# EAGLE design M594X (EAGLE 6.6.0)
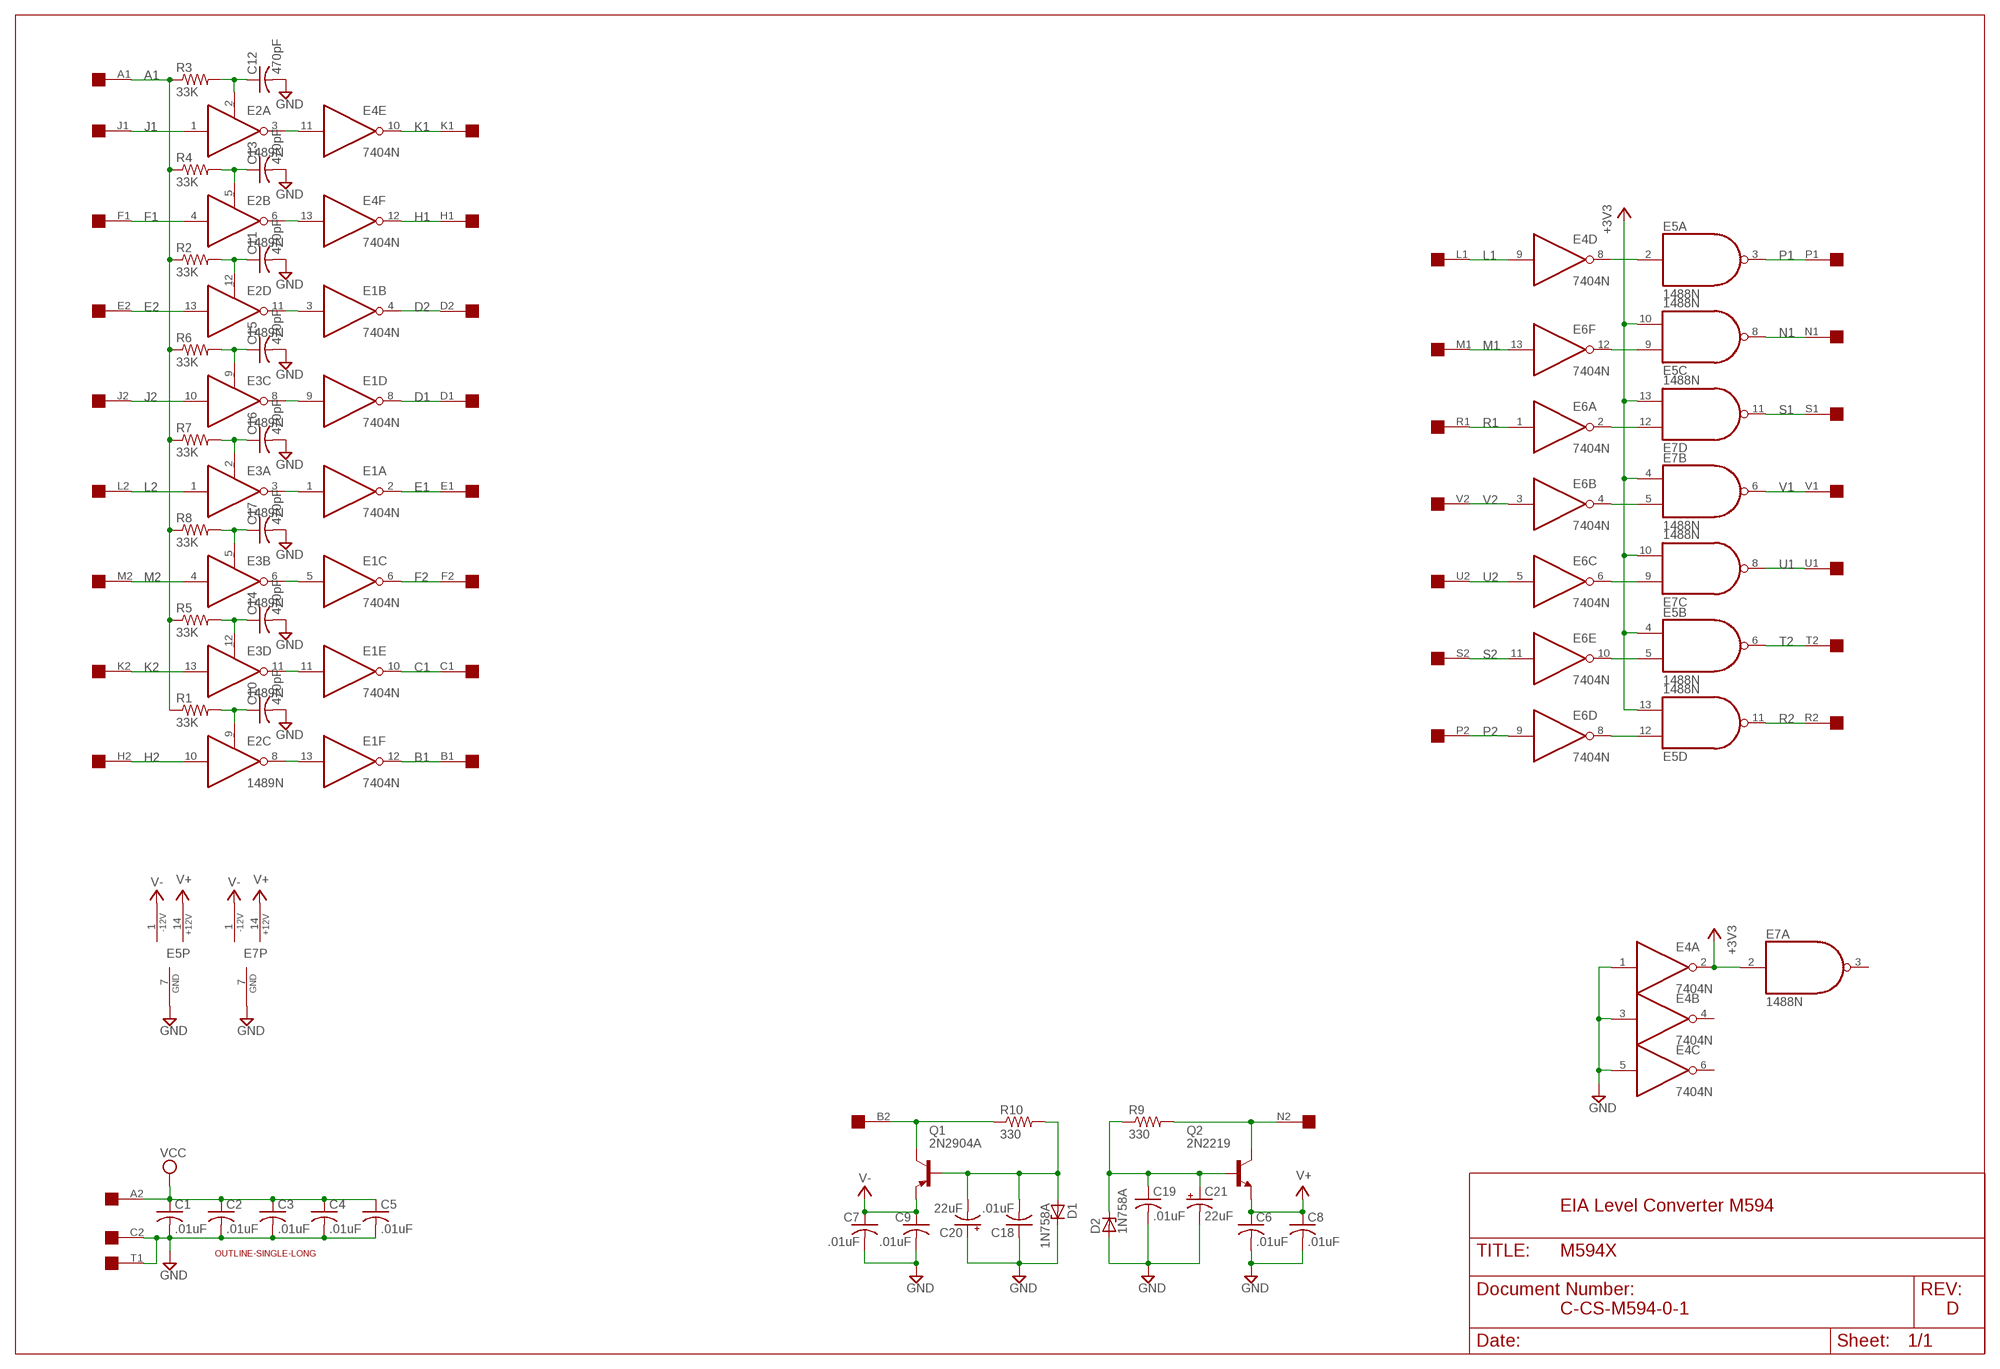
[diagram p0: schematic, sheet 1]

## Parts
C1  .01uF  C-US050-025X075  [C050-025X075]
C2  .01uF  C-US050-025X075  [C050-025X075]
C3  .01uF  C-US050-025X075  [C050-025X075]
C4  .01uF  C-US050-025X075  [C050-025X075]
C5  .01uF  C-US050-025X075  [C050-025X075]
C6  .01uF  C-US050-025X075  [C050-025X075]
C7  .01uF  C-US050-025X075  [C050-025X075]
C8  .01uF  C-US050-025X075  [C050-025X075]
C9  .01uF  C-US050-025X075  [C050-025X075]
C10  470pF  C-US075-032X103  [C075-032X103]
C11  470pF  C-US075-032X103  [C075-032X103]
C12  470pF  C-US075-032X103  [C075-032X103]
C13  470pF  C-US075-032X103  [C075-032X103]
C14  470pF  C-US075-032X103  [C075-032X103]
C15  470pF  C-US075-032X103  [C075-032X103]
C16  470pF  C-US075-032X103  [C075-032X103]
C17  470pF  C-US075-032X103  [C075-032X103]
C18  .01uF  C-US050-025X075  [C050-025X075]
C19  .01uF  C-US050-025X075  [C050-025X075]
C20  22uF  CPOL-USE20-8AXIAL  [E12-8]
C21  22uF  CPOL-USE20-8AXIAL  [E12-8]
D1  1N758A  ZENER-DIODEDO35Z10  [DO35Z10]
D2  1N758A  ZENER-DIODEDO35Z10  [DO35Z10]
E1  7404N  [DIL14]
E2  1489N  [DIL14]
E3  1489N  [DIL14]
E4  7404N  [DIL14]
E5  1488N  [DIL14]
E6  7404N  [DIL14]
E7  1488N  [DIL14]
Q1  2N2904A  -PNP-TO5  [TO5]
Q2  2N2219  -NPN-TO5  [TO5]
R1  33K  R-US_0207/10  [0207/10]
R2  33K  R-US_0207/10  [0207/10]
R3  33K  R-US_0207/10  [0207/10]
R4  33K  R-US_0207/10  [0207/10]
R5  33K  R-US_0207/10  [0207/10]
R6  33K  R-US_0207/10  [0207/10]
R7  33K  R-US_0207/10  [0207/10]
R8  33K  R-US_0207/10  [0207/10]
R9  330  R-US_0207/10  [0207/10]
R10  330  R-US_0207/10  [0207/10]
U$1  OUTLINE-SINGLE-LONG  [SINGLE-LONG]
U$2  SINGLE  [EDGE-CON2]

## Nets
+3V3: E4.2(A:O) E5.4(B:I0) E5.10(C:I1) E5.13(D:I1) E7.2(A:I) E7.4(B:I0) E7.10(C:I1) E7.13(D:I1)
A1 [supply]: R1.1 R2.1 R3.1 R4.1 R5.1 R6.1 R7.1 R8.1 U$2.A1
B1: E1.12(F:O) U$2.B1
B2 [supply]: Q1.3(C) R10.1 U$2.B2
C1: E1.10(E:O) U$2.C1
D1: E1.8(D:O) U$2.D1
D2: E1.4(B:O) U$2.D2
E1: E1.2(A:O) U$2.E1
E2: E2.13(D:I) U$2.E2
F1: E2.4(B:I) U$2.F1
F2: E1.6(C:O) U$2.F2
GND [supply]: C1.2 C2.2 C3.2 C4.2 C5.2 C6.2 C7.2 C8.2 C9.2 C10.2 C11.2 C12.2 C13.2 C14.2 C15.2 C16.2 C17.2 C18.1 C19.2 C20.+ C21.- D1.C D2.A E4.1(A:I) E4.3(B:I) E4.5(C:I) E5.7(P:GND) E7.7(P:GND) U$2.C2 U$2.T1
H1: E4.12(F:O) U$2.H1
H2: E2.10(C:I) U$2.H2
J1: E2.1(A:I) U$2.J1
J2: E3.10(C:I) U$2.J2
K1: E4.10(E:O) U$2.K1
K2: E3.13(D:I) U$2.K2
L1: E4.9(D:I) U$2.L1
L2: E3.1(A:I) U$2.L2
M1: E6.13(F:I) U$2.M1
M2: E3.4(B:I) U$2.M2
N1: E5.8(C:O) U$2.N1
N2 [supply]: Q2.3(C) R9.2 U$2.N2
N$1: C18.2 C20.- D1.A Q1.2(B) R10.2
N$2: C19.1 C21.+ D2.C Q2.2(B) R9.1
N$3: E4.8(D:O) E5.2(A:I)
N$4: E2.3(A:O) E4.11(E:I)
N$5: E5.9(C:I0) E6.12(F:O)
N$6: E6.2(A:O) E7.12(D:I0)
N$7: E6.4(B:O) E7.5(B:I1)
N$8: E6.6(C:O) E7.9(C:I0)
N$9: E5.5(B:I1) E6.10(E:O)
N$10: E5.12(D:I0) E6.8(D:O)
N$11: E2.6(B:O) E4.13(F:I)
N$12: E1.3(B:I) E2.11(D:O)
N$13: E1.9(D:I) E3.8(C:O)
N$14: E1.1(A:I) E3.3(A:O)
N$15: E1.5(C:I) E3.6(B:O)
N$16: E1.11(E:I) E3.11(D:O)
N$17: E1.13(F:I) E2.8(C:O)
N$18: C12.1 E2.2(A:RC) R3.2
N$20: C13.1 E2.5(B:RC) R4.2
N$21: C10.1 E2.9(C:RC) R1.2
N$22: C14.1 E3.12(D:RC) R5.2
N$23: C17.1 E3.5(B:RC) R8.2
N$24: C15.1 E3.9(C:RC) R6.2
N$25: C16.1 E3.2(A:RC) R7.2
N$26: C11.1 E2.12(D:RC) R2.2
P1: E5.3(A:O) U$2.P1
P2: E6.9(D:I) U$2.P2
R1: E6.1(A:I) U$2.R1
R2: E5.11(D:O) U$2.R2
S1: E7.11(D:O) U$2.S1
S2: E6.11(E:I) U$2.S2
T2: E5.6(B:O) U$2.T2
U1: E7.8(C:O) U$2.U1
U2: E6.5(C:I) U$2.U2
V1: E7.6(B:O) U$2.V1
V2: E6.3(B:I) U$2.V2
V+ [supply]: C6.1 C8.1 E5.14(P:+12V) E7.14(P:+12V) Q2.1(E)
V- [supply]: C7.1 C9.1 E5.1(P:-12V) E7.1(P:-12V) Q1.1(E)
VCC [supply]: C1.1 C2.1 C3.1 C4.1 C5.1 U$2.A2
Unconnected: E4.4(B:O) E4.6(C:O) E7.3(A:O)

## Notes on the sheet
- EIA Level Converter M594
- C-CS-M594-0-1 | D

## Power pins joined to a net without a drawn wire
GND: E1.7(P:GND) E2.7(P:GND) E3.7(P:GND) E4.7(P:GND) E6.7(P:GND)
VCC: E1.14(P:VCC) E2.14(P:VCC) E3.14(P:VCC) E4.14(P:VCC) E6.14(P:VCC)

## Library data of the parts
C1-C19 = rcl:C-US: CAPACITOR, American symbol
C20 C21 = dec-con:CPOL-USE20-8AXIAL: A 0.8 inch electrolytic.
D1 D2 = diode:ZENER-DIODE: Z-Diode
E1 E4 E6 = 74xx-us:74*04: Hex INVERTER
E2 E3 = dec-con:14*89: Quad line receivers BUFFER,
E5 E7 = dec-con:14*88: Quad 2-input NAND gate
Q1 = transistor:*-PNP-: PNP Transistror
Q2 = transistor:*-NPN-: NPN Transistror BF959 corrected 2008.03.06
R1-R10 = rcl:R-US_: RESISTOR, American symbol
U$1 = dec-con:OUTLINE-*: Board outlines for DEC boards.
U$2 = dec-con:SINGLE: Single-Height DEC board

## Net classes
1 supply: width 0.813 mm

## Board
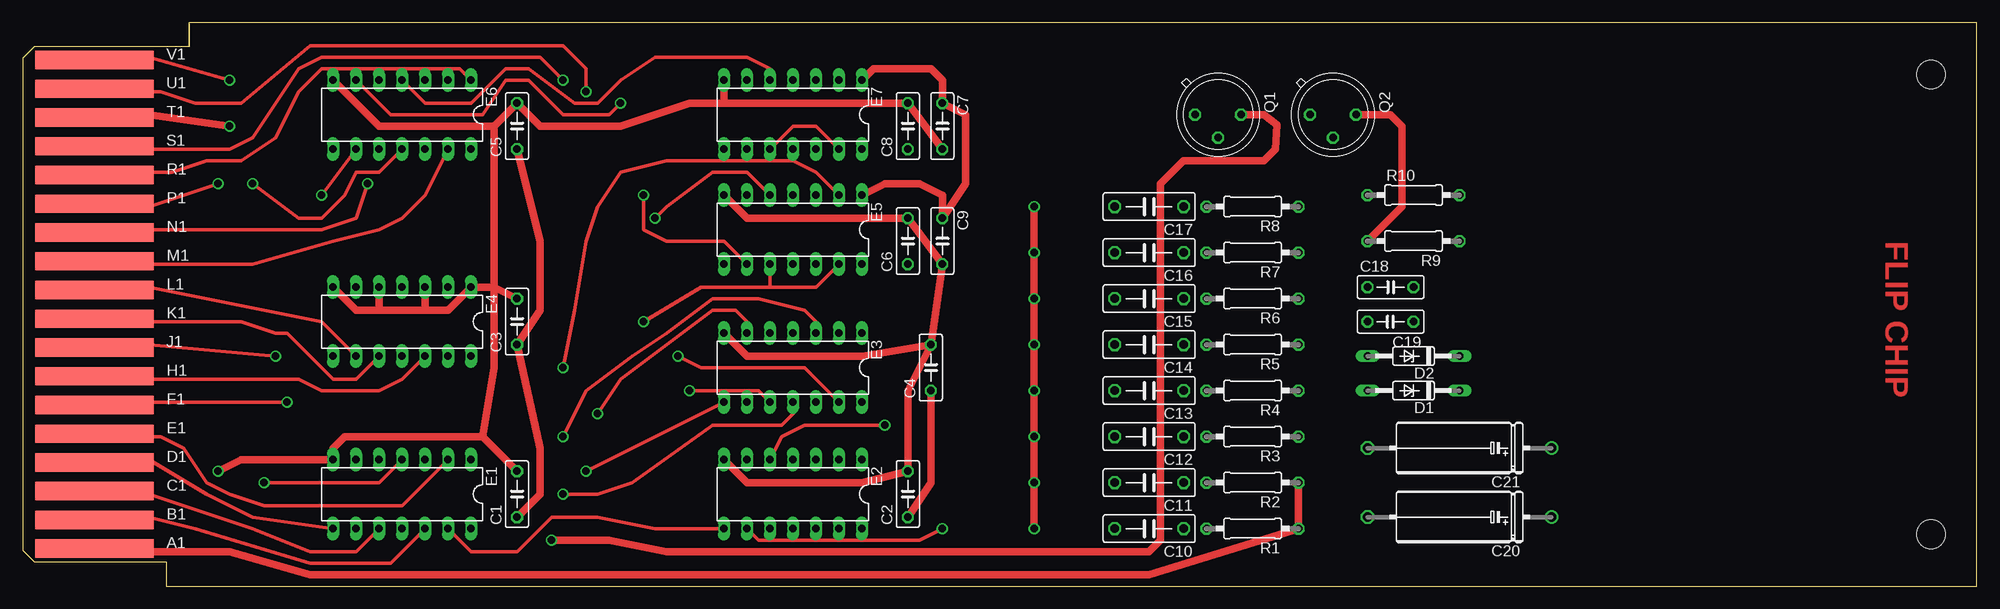
[diagram p1: board, top side]
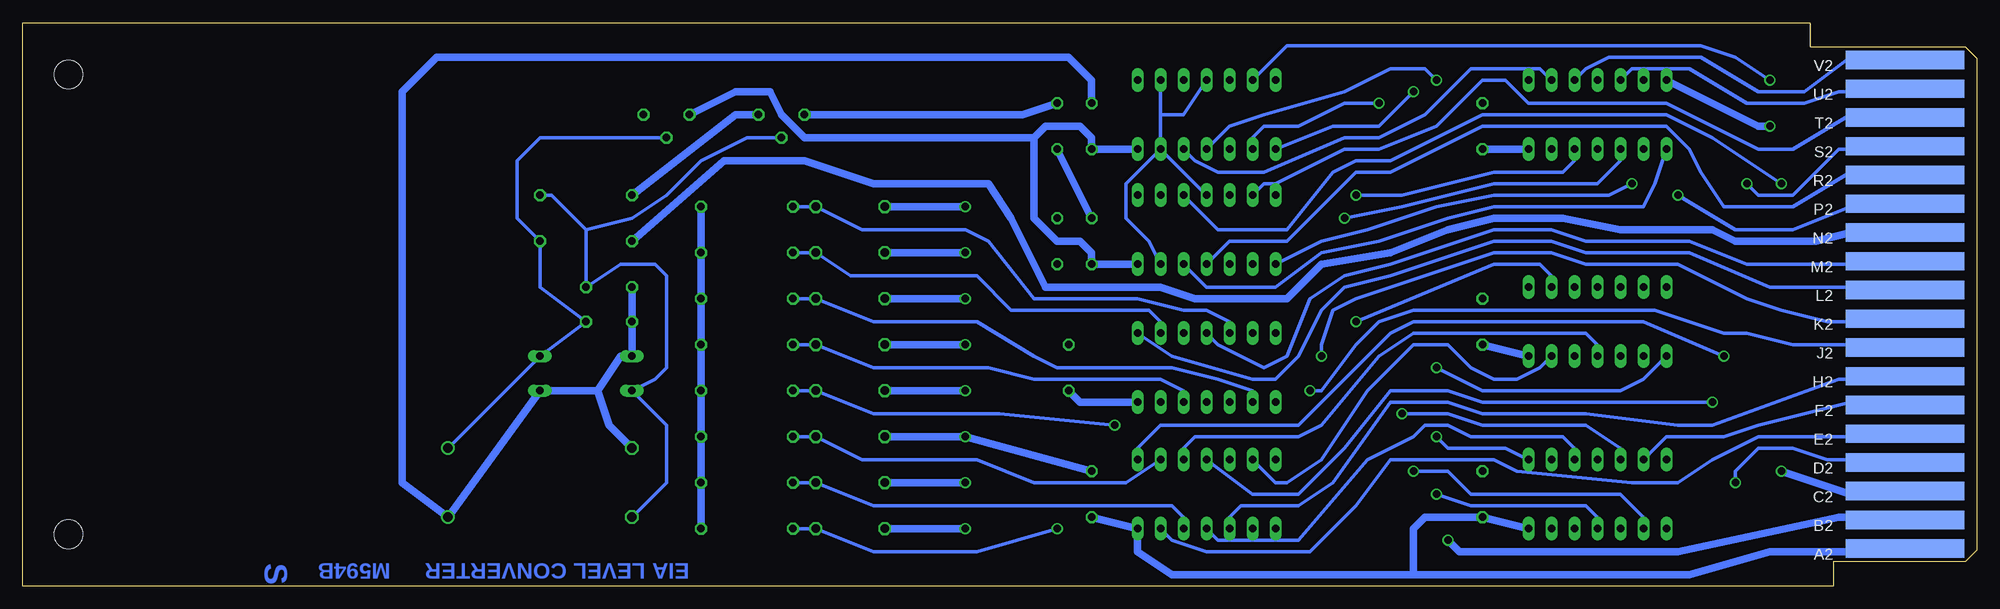
[diagram p2: board, bottom side, seen from below]

Size 215.9 x 62.23 mm. Coordinates in mm from the lower left corner, seen from the top.
Copper layers (1+16): Top 0.035mm / dielectric 1.5mm / Bottom 0.035mm
Design rules "16mils": minimum track width 16mil, minimum drill 32mil, track to track 15mil, track to pad 10mil, pad to pad 10mil, via to via 10mil, smd to smd 10mil, copper to edge 13mil, drill to drill 10mil, minimum pad ring 10mil, minimum via ring 8mil, stop-mask expansion 0mil, vias tented up to drill 0mil, thermal gap 10mil

### Footprints (pad centres in the part's own frame; a part is rotated, then mirrored left to right if it is on the bottom)
C050-025X075 = drill 0.813 octagon: 1 -2.54,0; 2 2.54,0
C075-032X103 = drill 0.914 octagon: 1 -3.81,0; 2 3.81,0
E12-8 = drill 1.016: + -10.16,0 | drill 1.016 octagon: - 10.16,0
DO35Z10 = drill 0.813 long: A 5.08,0; C -5.08,0
DIL14 = drill 0.813 long: 1 -7.62,-3.81; 2 -5.08,-3.81; 3 -2.54,-3.81; 4 0,-3.81; 5 2.54,-3.81; 6 5.08,-3.81; 7 7.62,-3.81; 8 7.62,3.81; 9 5.08,3.81; 10 2.54,3.81; 11 0,3.81; 12 -2.54,3.81; 13 -5.08,3.81; 14 -7.62,3.81
TO5 = drill 0.813 octagon: 1 0,-2.54; 2 2.54,0; 3 0,2.54
0207/10 = drill 0.813 octagon: 1 -5.08,0; 2 5.08,0
SINGLE-LONG = hole 3.175: 210.82,56.515; 210.82,5.715
EDGE-CON2 = smd 13.106 x 2.032: A1 7.938,4.128; B1 7.938,7.303; C1 7.938,10.477; D1 7.938,13.652; E1 7.938,16.828; F1 7.938,20.003; H1 7.938,23.177; J1 7.938,26.352; K1 7.938,29.527; L1 7.938,32.703; M1 7.938,35.877; N1 7.938,39.053; P1 7.938,42.227; R1 7.938,45.403; S1 7.938,48.578; T1 7.938,51.752; U1 7.938,54.928; V1 7.938,58.102 | smd 13.106 x 2.032 bottom: A2 7.938,4.128; B2 7.938,7.303; C2 7.938,10.477; D2 7.938,13.652; E2 7.938,16.828; F2 7.938,20.003; H2 7.938,23.177; J2 7.938,26.352; K2 7.938,29.527; L2 7.938,32.703; M2 7.938,35.877; N2 7.938,39.053; P2 7.938,42.227; R2 7.938,45.403; S2 7.938,48.578; T2 7.938,51.752; U2 7.938,54.928; V2 7.938,58.102

### Placement (x,y rotation side)
C1  54.61,10.16 90 top
C2  97.79,10.16 90 top
C3  54.61,29.21 90 top
C4  100.33,24.13 90 top
C5  54.61,50.8 90 top
C6  97.79,38.1 90 top
C7  101.6,50.8 270 top
C8  97.79,50.8 90 top
C9  101.6,38.1 270 top
C10  124.46,6.35 180 top
C11  124.46,11.43 180 top
C12  124.46,16.51 180 top
C13  124.46,21.59 180 top
C14  124.46,26.67 180 top
C15  124.46,31.75 180 top
C16  124.46,36.83 180 top
C17  124.46,41.91 180 top
C18  151.13,33.02 0 top
C19  151.13,29.21 180 top
C20  158.75,7.62 180 top
C21  158.75,15.24 180 top
D1  153.67,21.59 180 top
D2  153.67,25.4 180 top
E1  41.91,10.16 180 top
E2  85.09,10.16 180 top
E3  85.09,24.13 180 top
E4  41.91,29.21 180 top
E5  85.09,39.37 180 top
E6  41.91,52.07 180 top
E7  85.09,52.07 180 top
Q1  132.08,52.07 270 top
Q2  144.78,52.07 270 top
R1  135.89,6.35 180 top
R2  135.89,11.43 180 top
R3  135.89,16.51 180 top
R4  135.89,21.59 180 top
R5  135.89,26.67 180 top
R6  135.89,31.75 180 top
R7  135.89,36.83 180 top
R8  135.89,41.91 180 top
R9  153.67,38.1 180 top
R10  153.67,43.18 0 top
U$1  0,0 0 top
U$2  0,0 0 top

### Tracks (layer width: path | path; a pad name or v marks a point on that pad's centre or on a via)
+3V3  (via drill 0.81)
  Top 0.406: v68.58,29.21 74.93,33.02 82.55,33.02 | 82.55,33.02 E5.10 | E5.13 87.63,33.02 82.55,33.02 | E7.10 85.09,50.8 87.63,50.8 E7.13
  Bottom 0.406: E4.2 46.99,34.29 48.26,35.56 53.34,35.56 v68.58,29.21 | E7.2 90.17,52.07 | 90.17,52.07 E7.13 | E7.4 87.63,52.07 90.17,52.07 | E5.4 E7.13 | E5.13 91.44,38.1 93.98,40.64 93.98,44.45 E7.13
A1
  Top 0.813: U$2.A1 8.89,3.81 22.86,3.81 31.75,1.27 124.46,1.27 R1.1 R2.1
  Bottom 0.813: R8.1 R7.1 R6.1 R5.1 R4.1 R3.1 R2.1 R1.1
B1
  Top 0.406: U$2.B1 8.89,7.62 13.97,7.62 19.05,6.35 31.75,2.54 40.64,2.54 E1.12
B2  (via drill 0.81)
  Top 0.813: v58.42,5.08 64.77,5.08 71.12,3.81 124.46,3.81 125.73,5.08 125.73,44.45 128.27,46.99 137.16,46.99 138.43,48.26 138.57,50.98 137.16,52.07 Q1.3
  Bottom 0.813: Q1.3 137.16,52.07 R10.1 | U$2.B2 10.16,7.62 15.24,7.62 33.02,3.81 57.15,3.81 v58.42,5.08
C1
  Top 0.406: E1.10 36.83,3.81 31.75,3.81 25.4,6.35 13.97,10.16 8.89,10.16 U$2.C1
D1
  Top 0.406: U$2.D1 8.89,13.97 13.97,13.97 20.32,10.16 25.4,7.62 E1.8
D2  (via drill 0.81)
  Top 0.406: E1.4 39.37,11.43 v26.67,11.43
  Bottom 0.406: U$2.D2 10.16,13.97 16.51,13.97 20.32,15.24 24.13,15.24 26.67,12.7 v26.67,11.43
E1
  Top 0.406: U$2.E1 8.89,16.51 15.24,16.51 17.78,15.24 20.32,11.43 22.86,10.16 26.67,8.89 41.91,8.89 E1.2
E2
  Bottom 0.406: U$2.E2 10.16,16.51 24.13,16.51 29.21,13.97 33.02,11.43 38.1,11.43 50.8,12.7 53.34,13.97 64.77,13.97 68.58,8.89 73.66,3.81 85.09,3.81 88.9,5.08 E2.13
F1  (via drill 0.81)
  Top 0.406: U$2.F1 8.89,20.32 v29.21,20.32
  Bottom 0.406: E2.4 80.01,10.16 74.93,10.16 69.85,15.24 64.77,21.59 58.42,21.59 54.61,20.32 v29.21,20.32
F2
  Bottom 0.406: U$2.F2 10.16,20.32 13.97,20.32 24.13,17.78 27.94,16.51 34.29,16.51 E1.6
GND  (via drill 0.81)
  Top 0.813: v111.76,41.91 v111.76,36.83 v111.76,31.75 v111.76,26.67 v111.76,21.59 v111.76,16.51 v111.76,11.43 v111.76,6.35 | C7.2 C8.2 77.47,53.34 | v21.59,12.7 24.13,13.97 E1.7 34.29,15.24 35.56,16.51 50.8,16.51 | 50.8,16.51 C1.2 | 52.07,33.02 E4.1 46.99,30.48 44.45,30.48 | 52.07,33.02 C3.2 | 52.07,33.02 52.07,24.13 50.8,16.51 | 52.07,33.02 52.07,50.8 | U$2.T1 8.89,52.07 13.97,52.07 v22.86,50.8 | 52.07,50.8 C5.2 57.15,50.8 66.04,50.8 73.66,53.34 77.47,53.34 | E6.7 39.37,50.8 52.07,50.8 | E7.7 77.47,53.34 | E5.7 80.01,40.64 C6.2 C9.2 C4.2 | E3.7 80.01,25.4 92.71,25.4 C4.2 | E2.7 80.01,11.43 92.71,11.43 C2.2 97.79,21.59 C4.2 | E4.7 36.83,30.48 39.37,30.48 | 39.37,30.48 44.45,30.48 | E4.3 44.45,30.48 | E4.5 39.37,30.48
  Bottom 0.813: C2.2 v111.76,16.51 C12.2 | v111.76,21.59 C13.2 | v111.76,26.67 C14.2 | v111.76,31.75 C15.2 | v111.76,36.83 C16.2 | v111.76,41.91 C17.2 | v111.76,11.43 C11.2 | v111.76,6.35 C10.2 | C6.2 C7.2 | C8.2 97.79,55.88 100.33,58.42 170.18,58.42 173.99,54.61 173.99,11.43 C20.+ D1.C 152.4,21.59 | C21.- 151.13,17.78 152.4,21.59 | 152.4,21.59 149.86,25.4 D2.A C19.2 C18.1 | U$2.C2 10.16,10.16 13.97,10.16 v21.59,12.7 | E6.7 24.13,50.8 v22.86,50.8
H1
  Top 0.406: U$2.H1 8.89,22.86 30.48,22.86 33.02,21.59 39.37,21.59 41.91,22.86 E4.12
H2
  Bottom 0.406: U$2.H2 10.16,22.86 15.24,22.86 29.21,17.78 33.02,17.78 43.18,19.05 54.61,19.05 58.42,20.32 64.77,20.32 71.12,11.43 74.93,8.89 81.28,8.89 82.55,7.62 E2.10
J1  (via drill 0.81)
  Top 0.406: U$2.J1 8.89,26.67 13.97,26.67 v27.94,25.4
  Bottom 0.406: E2.1 92.71,15.24 90.17,17.78 74.93,17.78 64.77,27.94 62.23,29.21 36.83,29.21 v27.94,25.4
J2  (via drill 0.81)
  Top 0.406: v73.66,21.59 81.28,21.59 E3.10
  Bottom 0.406: U$2.J2 10.16,26.67 20.32,26.67 25.4,27.94 27.94,27.94 35.56,30.48 62.23,30.48 66.04,29.21 68.58,26.67 72.39,21.59 v73.66,21.59
K1
  Top 0.406: U$2.K1 8.89,29.21 24.13,29.21 27.94,27.94 29.21,27.94 34.29,22.86 36.83,22.86 E4.10
K2  (via drill 0.81)
  Top 0.406: v72.39,25.4 74.93,24.13 86.36,24.13 E3.13
  Bottom 0.406: U$2.K2 11.43,29.21 16.51,29.21 21.59,30.48 25.4,31.75 33.02,35.56 43.18,35.56 46.99,36.83 53.34,36.83 68.58,31.75 71.12,30.48 72.39,26.67 v72.39,25.4
L1
  Top 0.406: E4.9 33.02,29.21 13.97,33.02 8.89,33.02 U$2.L1
L2
  Bottom 0.406: E3.1 88.9,25.4 80.01,22.86 77.47,22.86 74.93,25.4 72.39,30.48 69.85,33.02 64.77,34.29 53.34,38.1 46.99,38.1 43.18,36.83 31.75,36.83 22.86,33.02 8.89,33.02 U$2.L2
M1
  Top 0.406: U$2.M1 8.89,35.56 25.4,35.56 34.29,38.1 39.37,39.37 41.91,40.64 44.45,43.18 E6.13
M2
  Bottom 0.406: U$2.M2 10.16,35.56 25.4,35.56 31.75,38.1 43.18,38.1 46.99,39.37 53.34,39.37 64.77,35.56 69.85,34.29 73.66,31.75 76.2,25.4 78.74,24.13 83.82,26.67 E3.4
N1  (via drill 0.81)
  Top 0.406: U$2.N1 8.89,39.37 33.02,39.37 36.83,40.64 v38.1,44.45
  Bottom 0.406: E5.8 72.39,38.1 67.31,39.37 59.69,41.91 53.34,43.18 40.64,43.18 v38.1,44.45
N2
  Top 0.813: Q2.3 151.13,52.07 152.4,50.8 152.4,41.91 R9.2
  Bottom 0.813: R9.2 138.43,46.99 129.54,46.99 121.92,44.45 109.22,44.45 106.68,40.64 102.87,33.02 90.17,33.02 86.36,31.75 76.2,31.75 72.39,35.56 64.77,36.83 58.42,39.37 53.34,40.64 45.72,40.64 39.37,39.37 29.21,39.37 26.67,38.1 17.78,38.1 12.7,39.37 U$2.N2
N$1
  Bottom 0.406: C20.- 144.78,11.43 144.78,17.78 D1.A 146.05,22.86 144.78,24.13 144.78,34.29 146.05,35.56 149.86,35.56 C18.2 153.67,39.37 | 153.67,39.37 157.48,43.18 R10.2 | Q1.2 135.89,49.53 140.97,46.99 144.78,43.18 148.59,40.64 153.67,39.37
N$2
  Bottom 0.406: Q2.2 158.75,49.53 161.29,46.99 161.29,40.64 R9.1 158.75,33.02 C19.1 D2.C C21.+
N$3  (via drill 0.81)
  Top 0.406: v59.69,24.13 60.96,30.48 62.23,38.1 63.5,41.91 66.04,45.72 71.12,46.99 85.09,46.99 87.63,45.72 E5.2
  Bottom 0.406: E4.8 36.83,22.86 39.37,21.59 54.61,21.59 v59.69,24.13
N$4
  Bottom 0.406: E2.3 87.63,15.24 86.36,16.51 74.93,16.51 72.39,17.78 66.04,25.4 62.23,27.94 43.18,27.94 41.91,26.67 E4.11
N$5  (via drill 0.81)
  Top 0.406: E5.9 77.47,38.1 71.12,38.1 68.58,39.37 v68.58,43.18
  Bottom 0.406: E6.12 44.45,46.99 45.72,45.72 53.34,45.72 63.5,43.18 v68.58,43.18
N$6
  Bottom 0.406: E6.2 48.26,57.15 55.88,57.15 60.96,52.07 66.04,49.53 69.85,49.53 78.74,45.72 83.82,45.72 86.36,46.99 E7.12
N$7
  Top 0.406: E6.4 44.45,53.34 49.53,53.34 53.34,57.15 55.88,57.15 60.96,53.34 63.5,53.34 66.04,55.88 69.85,58.42 80.01,58.42 82.55,57.15 E7.5
N$8  (via drill 0.81)
  Top 0.406: E6.6 40.64,52.07 50.8,52.07 53.34,55.88 55.88,55.88 59.69,52.07 64.77,52.07 v66.04,53.34
  Bottom 0.406: E7.9 80.01,49.53 78.74,50.8 74.93,50.8 69.85,53.34 v66.04,53.34
N$9  (via drill 0.81)
  Top 0.406: E5.5 80.01,45.72 76.2,45.72 71.12,41.91 v69.85,40.64
  Bottom 0.406: E6.10 39.37,46.99 41.91,44.45 53.34,44.45 63.5,41.91 v69.85,40.64
N$10
  Bottom 0.406: E5.12 85.09,33.02 77.47,33.02 72.39,36.83 66.04,38.1 58.42,40.64 53.34,41.91 36.83,41.91 35.56,44.45 E6.8
N$11
  Bottom 0.406: E2.6 77.47,11.43 76.2,11.43 72.39,13.97 67.31,21.59 62.23,26.67 58.42,26.67 55.88,24.13 53.34,22.86 50.8,22.86 48.26,24.13 E4.13
N$12
  Bottom 0.406: E2.11 83.82,5.08 74.93,5.08 67.31,13.97 62.23,16.51 60.96,17.78 58.42,17.78 55.88,16.51 45.72,16.51 44.45,15.24 E1.3
N$13  (via drill 0.81)
  Top 0.406: v62.23,12.7 E3.8
  Bottom 0.406: E1.9 36.83,7.62 39.37,10.16 55.88,10.16 58.42,12.7 v62.23,12.7
N$14  (via drill 0.81)
  Top 0.406: v59.69,16.51 62.23,21.59 67.31,25.4 71.12,27.94 76.2,31.75 81.28,31.75 86.36,30.48 87.63,29.21 E3.3
  Bottom 0.406: E1.1 52.07,15.24 58.42,15.24 v59.69,16.51
N$15  (via drill 0.81)
  Top 0.406: v63.5,19.05 66.04,22.86 76.2,30.48 78.74,30.48 80.01,29.21 E3.6
  Bottom 0.406: E1.5 39.37,15.24 43.18,17.78 54.61,17.78 58.42,19.05 v63.5,19.05
N$16  (via drill 0.81)
  Top 0.406: v59.69,10.16 63.5,10.16 67.31,11.43 76.2,17.78 83.82,17.78 85.09,19.05 E3.11
  Bottom 0.406: E1.11 41.91,7.62 43.18,8.89 55.88,8.89 v59.69,10.16
N$17
  Top 0.406: E1.13 49.53,3.81 54.61,3.81 58.42,7.62 63.5,7.62 69.85,6.35 E2.8
N$18
  Bottom 0.406: R3.2 C12.1 123.19,13.97 110.49,13.97 104.14,11.43 93.98,11.43 E2.2
N$20  (via drill 0.81)
  Top 0.406: v95.25,17.78 86.36,17.78 83.82,16.51 E2.5
  Bottom 0.406: R4.2 C13.1 121.92,19.05 107.95,19.05 v95.25,17.78
N$21  (via drill 0.81)
  Top 0.406: E2.9 81.28,5.08 99.06,5.08 v101.6,6.35
  Bottom 0.406: R1.2 C10.1 121.92,3.81 110.49,3.81 v101.6,6.35
N$22
  Bottom 0.406: E3.12 87.63,21.59 90.17,22.86 104.14,22.86 109.22,24.13 121.92,24.13 C14.1 R5.2
N$23
  Bottom 0.406: E3.5 82.55,29.21 85.09,30.48 87.63,30.48 92.71,31.75 104.14,31.75 109.22,38.1 111.76,39.37 123.19,39.37 C17.1 R8.2
N$24
  Bottom 0.406: E3.9 80.01,21.59 83.82,22.86 88.9,24.13 101.6,24.13 104.14,25.4 110.49,29.21 121.92,29.21 C15.1 R6.2
N$25
  Bottom 0.406: E3.2 90.17,29.21 91.44,30.48 106.68,30.48 110.49,34.29 124.46,34.29 C16.1 R7.2
N$26
  Bottom 0.406: R2.2 C11.1 121.92,8.89 88.9,8.89 87.63,7.62 E2.12
P1  (via drill 0.81)
  Top 0.406: U$2.P1 8.89,41.91 13.97,41.91 v21.59,44.45
  Bottom 0.406: E5.3 83.82,39.37 76.2,39.37 71.12,45.72 68.58,46.99 64.77,46.99 54.61,52.07 34.29,52.07 29.21,49.53 v21.59,44.45
P2  (via drill 0.81)
  Top 0.406: E6.9 v33.02,43.18
  Bottom 0.406: U$2.P2 10.16,41.91 13.97,41.91 20.32,39.37 26.67,39.37 v33.02,43.18
R1
  Top 0.406: U$2.R1 8.89,45.72 16.51,45.72 20.32,46.99 24.13,46.99 27.94,49.53 30.48,54.61 33.02,57.15 48.26,57.15 E6.1
R2
  Bottom 0.406: U$2.R2 10.16,45.72 13.97,45.72 20.32,41.91 27.94,41.91 30.48,45.72 31.75,48.26 34.29,50.8 54.61,50.8 64.77,45.72 68.58,45.72 76.2,38.1 82.55,38.1 E5.11
S1  (via drill 0.81)
  Top 0.406: v59.69,55.88 57.15,58.42 33.02,58.42 30.48,57.15 25.4,49.53 22.86,48.26 8.89,48.26 U$2.S1
  Bottom 0.406: E7.11 82.55,50.8 78.74,52.07 69.85,54.61 64.77,57.15 60.96,57.15 v59.69,55.88
S2  (via drill 0.81)
  Top 0.406: E6.11 39.37,45.72 36.83,45.72 35.56,43.18 33.02,40.64 30.48,40.64 v25.4,44.45
  Bottom 0.406: U$2.S2 10.16,48.26 15.24,48.26 20.32,43.18 24.13,43.18 v25.4,44.45
T2
  Bottom 0.406: U$2.T2 8.89,52.07 13.97,52.07 20.32,48.26 24.13,48.26 34.29,53.34 49.53,53.34 52.07,55.88 54.61,55.88 59.69,50.8 66.04,48.26 69.85,48.26 77.47,44.45 78.74,44.45 E5.6
U1  (via drill 0.81)
  Top 0.406: U$2.U1 8.89,54.61 15.24,54.61 19.05,53.34 24.13,53.34 31.75,59.69 59.69,59.69 62.23,57.15 v62.23,54.61
  Bottom 0.406: E7.8 71.12,50.8 66.04,50.8 v62.23,54.61
U2
  Bottom 0.406: U$2.U2 10.16,54.61 15.24,54.61 19.05,53.34 25.4,53.34 31.75,57.15 38.1,57.15 E6.5
V1  (via drill 0.81)
  Top 0.406: U$2.V1 8.89,58.42 13.97,58.42 v22.86,55.88
  Bottom 0.406: E7.6 76.2,59.69 30.48,59.69 26.67,58.42 v22.86,55.88
V2
  Bottom 0.406: U$2.V2 10.16,58.42 13.97,58.42 19.05,54.61 24.13,54.61 30.48,58.42 40.64,58.42 43.18,57.15 E6.3
V+
  Bottom 0.813: E7.14 C8.1 97.79,49.53 99.06,50.8 102.87,50.8 104.14,49.53 | E5.14 C6.1 97.79,36.83 99.06,38.1 101.6,38.1 104.14,40.64 104.14,49.53 | Q2.1 137.16,54.61 133.35,54.61 132.08,52.07 129.54,49.53 104.14,49.53
V-
  Top 0.813: E7.1 93.98,57.15 100.33,57.15 101.6,55.88 C7.1 104.14,52.07 104.14,44.45 C9.1 101.6,43.18 99.06,44.45 95.25,44.45 E5.1
  Bottom 0.813: C7.1 105.41,52.07 Q1.1
VCC
  Top 0.813: C5.1 57.15,38.1 57.15,30.48 C3.1 57.15,15.24 57.15,10.16 C1.1 | C2.1 100.33,11.43 C4.1
  Bottom 0.813: C2.1 E2.14 92.71,3.81 88.9,1.27 62.23,1.27 | E3.14 99.06,20.32 C4.1 | U$2.A2 8.89,3.81 22.86,3.81 31.75,1.27 62.23,1.27 | 62.23,1.27 62.23,6.35 60.96,7.62 C1.1 E1.14 | E4.14 C3.1 | E6.14 C5.1

### Text on the board
Top: FLIP CHIP
Bottom: EIA LEVEL CONVERTER | M594B | S